# Altium schematic sheet ESP_Grow_Main_V2_3_Con.SchDoc: Connectors
size A; Revision: A; SheetNumber: 3; SheetTotal: 5
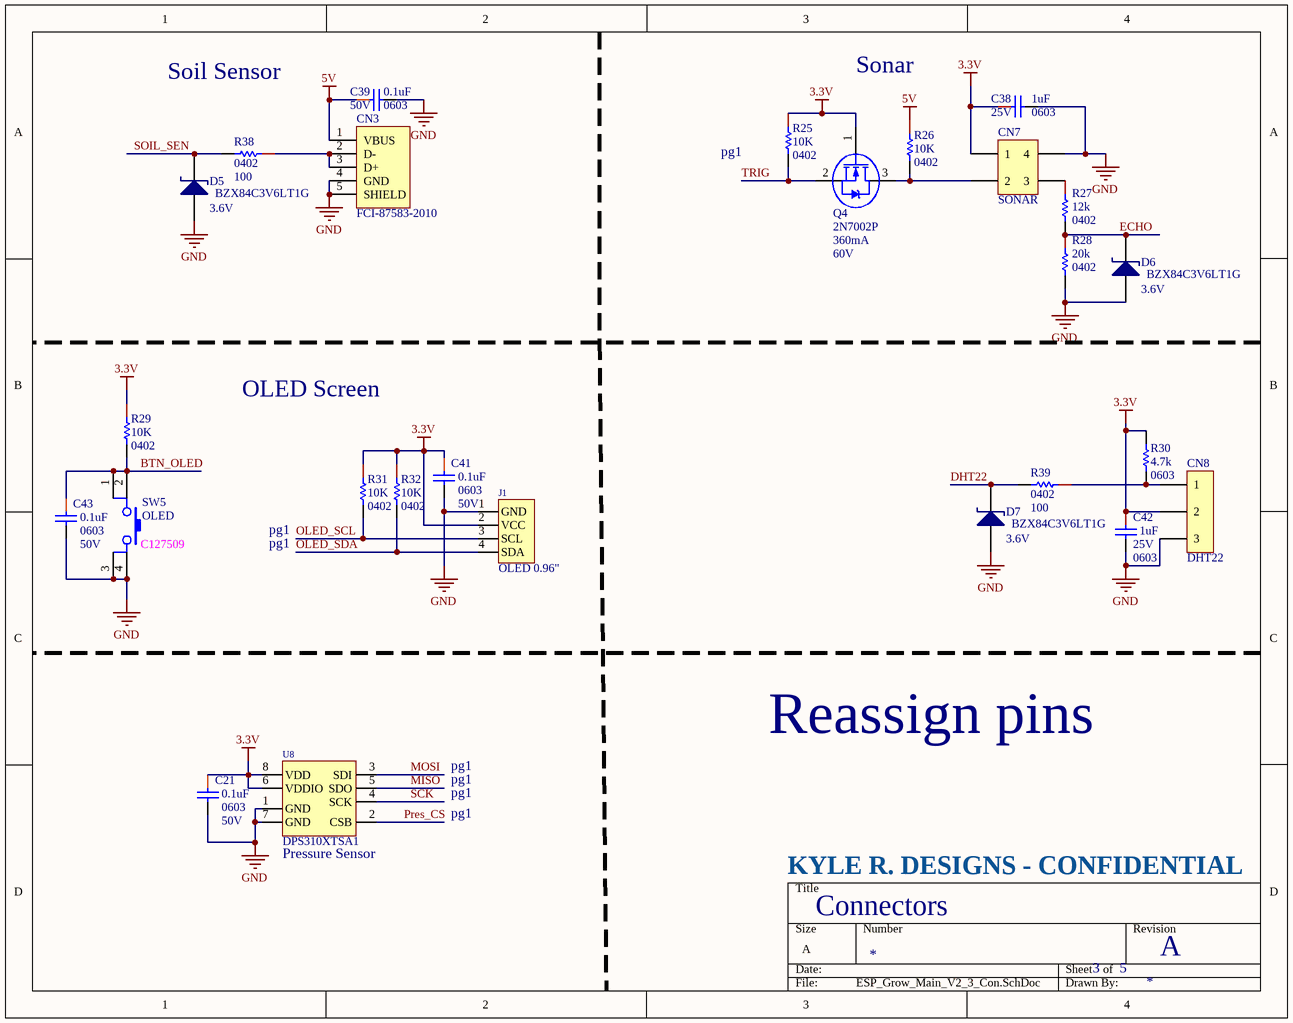
[diagram p0: ESP_Grow_Main_V2_3_Con.SchDoc]

## Parts
C21  Package / Case: 0603  Voltage - Rated: 50V  [CAPC0603(1608)_L]  (hidden comment: 0.1uF)
C38  1uF  Voltage - Rated: 25V  Package / Case: 0603  [CAPC0603(1608)_N]
C39  Package / Case: 0603  Voltage - Rated: 50V  [CAPC0603(1608)_L]  (hidden comment: 0.1uF)
C41  Package / Case: 0603  Voltage - Rated: 50V  [CAPC0603(1608)_L]  (hidden comment: 0.1uF)
C42  1uF  Voltage - Rated: 25V  Package / Case: 0603  [CAPC0603(1608)_N]
C43  Package / Case: 0603  Voltage - Rated: 50V  [CAPC0603(1608)_L]  (hidden comment: 0.1uF)
CN3  FCI-87583-2010  [87583-2010]
CN7  SONAR  [Molex 2x2 Microfit 90deg]
CN8  DHT22  [Molex 1x3 Microfit 90deg]
D5  BZX84C3V6LT1G  Voltage Rating (DC): 3.6V  [SOT23]
D6  BZX84C3V6LT1G  Voltage Rating (DC): 3.6V  [SOT23]
D7  BZX84C3V6LT1G  Voltage Rating (DC): 3.6V  [SOT23]
J1  OLED 0.96"  [OLED_0.96_I2C]
Q4  2N7002P  Continuous Drain Current (ID): 360mA  Drain to Source Voltage (Vdss): 60V  [SOT23]
R25  Resistance: 10K  Package: 0402  [RESC0402(1005)_N]  (hidden comment: 0402WGF1002TCE)
R26  Resistance: 10K  Package: 0402  [RESC0402(1005)_N]  (hidden comment: 0402WGF1002TCE)
R27  Package (Imperial): 0402  Resistance: 12k  [RESC0402(1005)_M]  (hidden comment: RES 12K OHM 1% 1/16W 0402)
R28  Package (Imperial): 0402  [RESC0402(1005)_L]  (hidden comment: 20K)
R29  Resistance: 10K  Package: 0402  [RESC0402(1005)_N]  (hidden comment: 0402WGF1002TCE)
R30  Package / Case: 0603  [RESC0603(1608)_N]  (hidden comment: 4.7K)
R31  Resistance: 10K  Package: 0402  [RESC0402(1005)_N]  (hidden comment: 0402WGF1002TCE)
R32  Resistance: 10K  Package: 0402  [RESC0402(1005)_N]  (hidden comment: 0402WGF1002TCE)
R38  Package (Imperial): 0402  [RESC0402(1005)_M]  (hidden comment: 100)
R39  Package (Imperial): 0402  [RESC0402(1005)_M]  (hidden comment: 100)
SW5  OLED  [SW TACT Red 6mm x 6mm]
U8  DPS310XTSA1  [Infineon_PG-VLGA-8]

## Nets
3.3V: C21.1 C38.1 C41.1 C42.1 CN7.1 CN8.2 J1.2(VCC) Q4.1(G) R25.1 R29.1 R30.2 R31.1 R32.1 U8.6(VDDIO) U8.8(VDD)
5V: C39.1 CN3.1(VBUS) R26.1
GND: C21.2 C38.2 C39.2 C41.2 C42.2 C43.2 CN3.4(GND) CN3.5(SHIELD) CN7.4 CN8.3 D5.1(A) D6.1(A) D7.1(A) J1.1(GND) R28.2 SW5.3 SW5.4 U8.1(GND) U8.7(GND)
BTN_OLED: C43.1 R29.2 SW5.1 SW5.2
DHT22: D7.3(K) R39.2
ECHO: D6.3(K) R27.2 R28.1
MISO: U8.5(SDO)
MOSI: U8.3(SDI)
OLED_SCL: J1.3(SCL) R31.2
OLED_SDA: J1.4(SDA) R32.2
Pres_CS: U8.2(CSB)
SCK: U8.4(SCK)
SOIL_SEN: D5.3(K) R38.2
TRIG: Q4.2(S) R25.2
NetCN3_2: CN3.2(D-) CN3.3(D+) R38.1
NetCN7_2: CN7.2 Q4.3(D) R26.2
NetCN7_3: CN7.3 R27.1
NetCN8_1: CN8.1 R30.1 R39.1

## Notes on the sheet
- Soil Sensor
- Sonar
- (near R25) pg1
- OLED Screen
- (near SW5) C127509
- pg1
- Reassign pins
- (near U8) Pressure Sensor
- KYLE R. DESIGNS - CONFIDENTIAL

## Library data of the parts
C21 C39 C41 C43 = 0.1uF_0603: 100NF 50V 0603; Manufacturer: YAGEO; Manufacturer Part Number: CC0603KRX7R9BB104; Tolerance: ±10%; Temperature Coefficient: X7R; Supplier 1: Digi-Key; RoHS: RoHS Compliant; Category: Capacitors; Stock 1: 2360000; Pricing 1: 4000=0.00414, 8000=0.00378, 12000=0.0036, 28000=0.00342, 100000=0.00248 (USD); Packaging: Tape & Reel (TR); Mounting Type: Surface Mount, MLCC; Operating Temperature: -55°C ~ 125°C; Applications: General Purpose; Ratings: -; Size / Dimension: 0.063" L x 0.031" W (1.60mm x 0.80mm); Height - Seated (Max): -; Thickness (Max): 0.034" (0.87mm); Lead Spacing: -; Features: -; Lead Style: -; ComponentLink1URL: http://www.kemet.com/datasheets&C0603C104K4RACTU; ComponentLink1Description: http://www.kemet.com/datasheets&C0603C104K4RACTU; Supplier Part Number 1: 399-1096-2-ND; ComponentLink2Description: New link; ComponentLink2URL: *; LCSC Part #: C14663; Capacitance: 0.1uF
C38 C42 = CAP CER 1UF 25V 10% X7R 0603: 1uF 0603 25V; Manufacturer: TDK Corporation; Manufacturer Part Number: CGA3E1X7R1E105K080AC; Tolerance: ±10%; Temperature Coefficient: X7R; Supplier 1: Digi-Key; RoHS: RoHS Compliant; Category: Capacitors; Stock 1: 360610; Pricing 1: 1=0.2, 10=0.135, 100=0.0686, 500=0.04696, 1000=0.04154 (USD); Packaging: Cut Tape (CT); Part Status: Active; Operating Temperature: -55°C ~ 125°C; Features: -; Ratings: AEC-Q200; Applications: Automotive; Failure Rate: -; Mounting Type: Surface Mount, MLCC; Size / Dimension: 0.063" L x 0.032" W (1.60mm x 0.80mm); Height - Seated (Max): -; Thickness (Max): 0.035" (0.90mm); Lead Spacing: -; Lead Style: -; ComponentLink1URL: https://product.tdk.com/info/en/catalog/datasheets/mlcc_automotive_general_en.pdf; ComponentLink1Description: https://product.tdk.com/info/en/catalog/datasheets/mlcc_automotive_general_en.pdf; Supplier Part Number 1: 445-6931-1-ND
CN3 = CMP-001-0212-04: USB-A Receptacle; Manufacturer Part Number: 87583-2010BLF; Manufacturer: FCI; Vendor: Digikey; PN: 609-4413-ND; Number of Contacts: 4; Specifications: USB 2.0; ComponentLink1Description: http://portal.fciconnect.com/Comergent//fci/drawing/87583.pdf; Gender: Receptacle; Connector Type: USB - A; Stock 1: 25474; Packaging: Tube; Mounting Type: Surface Mount, Right Angle, Horizontal; Ingress Protection: -; Component Name: FCI-87583-2010; MPN: 87583-2010BLF; ComponentLink1URL: http://portal.fciconnect.com/Comergent//fci/drawing/87583.pdf; Series: 87583; Pin Count: 5; RoHS: RoHS Compliant; Features: Board Lock; Pricing 1: 1=0.89, 10=0.78, 25=0.7344, 50=0.7038, 100=0.6732, 250=0.612, 500=0.5508, 1000=0.4896, 2500=0.4437 (USD); Designator: FCI-87583-2010
CN7 = MICROFIT 3.0 HDR 90deg 4CKT: Molex Microfit 2x2 90deg Header; Manufacturer: Molex Inc; Manufacturer Part Number: 0430450400; Connector Type: Header, Shrouded; Number of Positions: 4; Number of Positions Loaded: All; Pitch: 0.118" (3.00mm); ClassName: *; Supplier 1: Digi-Key; RoHS: RoHS Compliant; Category: Connectors, Interconnects; Stock 1: 9668; Pricing 1: 1=1.35, 10=1.228, 50=1.1026, 100=1.0525, 250=0.95228, 500=0.8771, 1000=0.7518, 2500=0.70168, 5000=0.6666 (USD); Packaging: Tray; Contact Type: Male Pin; Number of Rows: 2; Row Spacing: 0.118" (3.00mm); Contact Mating Length: -; Mounting Type: Through Hole, Right Angle; Termination: Solder; Fastening Type: Locking Ramp; Features: Board Lock; Contact Finish: Tin; Contact Finish Thickness: 100µin (2.54µm); Color: Black; ComponentLink1URL: http://www.molex.com/pdm_docs/sd/430450400_sd.pdf; ComponentLink1Description: http://www.molex.com/pdm_docs/sd/430450400_sd.pdf; Supplier Part Number 1: WM1814-ND
CN8 = MICROFIT 3.0 HDR 90deg 3CKT: Molex Microfit 1x3 90deg Header; Manufacturer: Molex Inc; Manufacturer Part Number: 0436500304; Connector Type: Header, Shrouded; Number of Positions: 3; Number of Positions Loaded: All; Pitch: 0.118" (3.00mm); ClassName: *; Supplier 1: Digi-Key; RoHS: RoHS Compliant; Category: Connectors, Interconnects; Stock 1: 42564; Pricing 1: 1=1.39, 10=1.224, 50=1.104, 100=1.056, 250=0.96, 500=0.864, 1000=0.768, 2500=0.696, 5000=0.672 (USD); Packaging: Tray; Contact Type: Male Pin; Number of Rows: 1; Row Spacing: -; Contact Mating Length: -; Mounting Type: Through Hole, Right Angle; Termination: Solder; Fastening Type: Locking Ramp; Features: Board Lock; Contact Finish: Gold; Contact Finish Thickness: 15µin (0.38µm); Color: Black; ComponentLink1URL: http://www.molex.com/pdm_docs/sd/436500304_sd.pdf; ComponentLink1Description: http://www.molex.com/pdm_docs/sd/436500304_sd.pdf; Supplier Part Number 1: WM1876-ND
D5-D7 = CMP-001-0958-01: DIODE ZENER 3.6V 225MW SOT23-3; ESD Protection: Yes; Tolerance: 6%; Forward Voltage: 900mV; Element Configuration: Single; Peak Reverse Current: 5uA; Zener Current: 10mA; Power Dissipation: 300mW; Test Current: 5mA; Impedance: 90R; Material: Plastic; Max Power Dissipation: 225mW; Halogen Free: Halogen Free; Lead Free: Lead Free; Power Rating: 225mW; REACH SVHC: No SVHC; Radiation Hardening: No; Number of Pins: 3; Working Voltage: 3.6V; Contact Plating: Tin,Matte; Case/Package: SOT-23-3; Length: 0.119inch; Voltage Tolerance: 6%; Max Operating Temperature: 150°C; Packaging: Tape and Reel; Package Quantity: 3000; Width: 0.055inch; Min Operating Temperature: -65°C; Zener Voltage: 3.6V; Height: 0.044inch; Max Reverse Leakage Current: 5uA
J1 = OLED_0.96_I2C: SSD1306 I2C OLED 0.96"
Q4 = CMP-012-0002-05: MOSFET N-CH 60V 0.36A SOT-23; Drain to Source Resistance: 1.6R; Gate to Source Voltage (Vgs): 20V; Turn-Off Delay Time: 10ns; Input Capacitance: 50pF; Max Power Dissipation: 350mW; Rise Time: 4ns; Fall Time: 5ns; Number of Elements: 1; Power Dissipation: 420mW; Turn-On Delay Time: 3ns; Contact Plating: Tin; Case/Package: SOT; Number of Pins: 3; Rds On Max: 1.6R; Package Quantity: 10000; Lead Free: Lead Free; Packaging: Tape and Reel; Max Dual Supply Voltage: 60V; Min Operating Temperature: -55°C; Radiation Hardening: No; Drain to Source Breakdown Voltage: 60V; Max Operating Temperature: 150°C
R25 R26 R29 R31 R32 = 10k_0402: 10KOHMS ±1% 1/10W 0402; Supplier Part Number 1: C25744; Manufacturer Part Number 1: 0402WGF1002TCE; Supplier 1: LCSC
R27 = CMP-007-0374-13: 12 kOhms ±1% 0.063W, 1/16W Chip Resistor 0402 (1005 Metric) Automotive AEC-Q200 Thick Film; Power: 63mW; Temperature Coefficient: ±100ppm/°C; Package (Metric): 1005; Termination: SMD/SMT; Tolerance: 1%; Height: 400µm; Operating Temperature: -55°C ~ 155°C; Length: 1mm
R28 = CMP-007-0427-12: RES 20K OHM 1% 1/10W 0402; Power: 63mW; Temperature Coefficient: ±100ppm/°C; Package (Metric): 1005; Tolerance: 1%; Length: 1mm; Resistance: 20k; Operating Temperature: -55°C ~ 155°C; Termination: SMD/SMT; Height: 400µm
R30 = RES 4.7K OHM 1/10W 5% 0603 SMD: 4.7K 0603; Manufacturer: Panasonic Electronic Components; Manufacturer Part Number: ERJ-3GEYJ472V; Tolerance: ±5%; Power (Watts): 0.1W, 1/10W; Temperature Coefficient: ±200ppm/°C; Supplier 1: Digi-Key; RoHS: RoHS Compliant; Category: Resistors; Stock 1: 1261582; Pricing 1: 1=0.1, 50=0.0126, 100=0.0096, 250=0.00716, 500=0.00528, 1000=0.00352, 2500=0.00297 (USD); Packaging: Cut Tape (CT); Resistance (Ohms): 4.7k; Composition: Thick Film; Features: Automotive AEC-Q200 Qualified; Supplier Device Package: 0603; Size / Dimension: 0.063" L x 0.031" W (1.60mm x 0.80mm); Height: 0.022" (0.55mm); Number of Terminations: 2; ComponentLink1URL: http://industrial.panasonic.com/www-cgi/jvcr13pz.cgi?E+PZ+3+AOA0001+ERJ3GEYJ472V+7+WW; ComponentLink1Description: http://industrial.panasonic.com/www-cgi/jvcr13pz.cgi?E+PZ+3+AOA0001+ERJ3GEYJ472V+7+WW; Supplier Part Number 1: P4.7KGCT-ND
R38 R39 = CMP-007-0350-06: RES 100 OHM 1% 1/16W 0402; Power: 63mW; Temperature Coefficient: ±100ppm/°C; Package (Metric): 1005; Operating Temperature: -55°C ~ 155°C; Termination: SMD/SMT; Resistance: 100; Length: 1mm; Height: 400µm; Tolerance: 1%
SW5 = PTS645SM43SMTR92 LFS: SWITCH TACTILE SPST-NO 0.05A 12V; Manufacturer: C&K; Switch Function: Off-Mom; Contact Rating @ Voltage: 0.05A @ 12VDC; Actuator Type: Standard; Actuator Height off PCB, Vertical: 4.30mm; Actuator Orientation: Top Actuated; Outline: 6.00mm x 6.00mm; Illumination: Non-Illuminated; Operating Force: 160gf; Actuator Material: Polyamide (PA66), Nylon 6/6; Mechanical Life: 100,000 Cycles; ClassName: *; Supplier 1: Digi-Key; Manufacturer Part Number: PTS645SM43SMTR92 LFS; RoHS: RoHS Compliant; Category: Switches; Stock 1: 234699; Pricing 1: 1=0.15, 10=0.147, 25=0.1416, 50=0.1366, 100=0.129, 250=0.12144, 500=0.11638 (USD); Packaging: Cut Tape (CT); Part Status: Active; Circuit: SPST-NO; Mounting Type: Surface Mount; Actuator Length, Right Angle: -; Termination Style: Gull Wing; Illumination Type, Color: -; Illumination Voltage (Nominal): -; Ingress Protection: -; Features: Blue Actuator; Switch Travel: -; Operating Temperature: -20°C ~ 60°C; ComponentLink1URL: http://www.ckswitches.com/media/1471/pts645.pdf; ComponentLink1Description: http://www.ckswitches.com/media/1471/pts645.pdf; Supplier Part Number 1: CKN9112CT-ND
U8 = DPS310: SENSOR PRESSURE CAPACITIVE; Pressure Type: Vented Gauge; Operating Pressure: 4.35PSI ~ 17.4PSI (30kPa ~ 120kPa); Output Type: I²C, SPI; Voltage - Supply: 1.7V ~ 3.6V; Accuracy: ±0.5°C; Supplier 1: Digi-Key; Supplier Part Number 1: DPS310XTSA1CT-ND; Package / Case: 8-VFLGA